# EAGLE design 4_relay_5Switch (EAGLE 7.2.0)
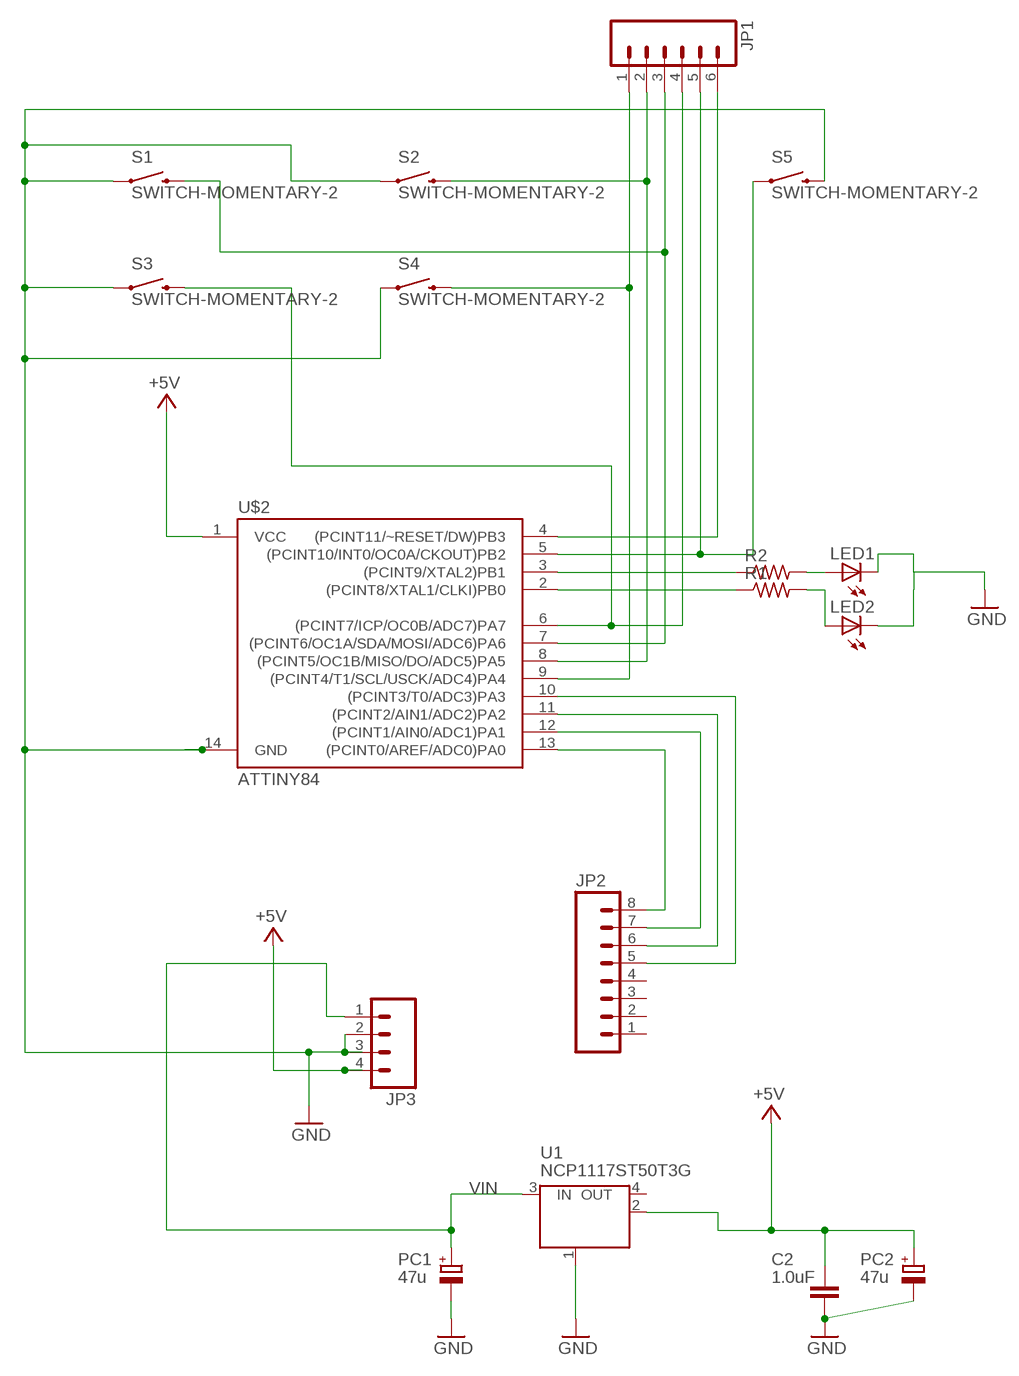
[diagram p0: schematic, sheet 1]

## Parts
C2  1.0uF  1.0UF-25V-+80/-20(0805)  [0805]
JP1  M06NO_SILK_FEMALE_PTH  [1X06_NO_SILK]
JP2  M08NO_SILK  [1X08_PIN1_NO_SILK]
JP3  M041X04_NO_SILK  [1X04_NO_SILK]
LED1  LEDCHIP-LED0805  [CHIP-LED0805]
LED2  LEDCHIP-LED0805  [CHIP-LED0805]
PC1  47u  CPOL-EUE2.5-5V  [E2,5-4R]
PC2  47u  CPOL-EUE2.5-5V  [E2,5-4R]
R1  R-US_R0805  [R0805]
R2  R-US_R0805  [R0805]
S1  SWITCH-MOMENTARY-2  [TACTILE_FSM4JSMATR]
S2  SWITCH-MOMENTARY-2  [TACTILE_FSM4JSMATR]
S3  SWITCH-MOMENTARY-2  [TACTILE_FSM4JSMATR]
S4  SWITCH-MOMENTARY-2  [TACTILE_FSM4JSMATR]
S5  SWITCH-MOMENTARY-2  [TACTILE_FSM4JSMATR]
U1  NCP1117ST50T3G  MC33269ST-3.3T3  [SOT223]
U$2  ATTINY84  [SO14]

## Nets
+5V [usbvcc]: C2.2 JP3.4 PC2.+ U1.2(OUT) U$2.1(VCC)
GND: C2.1 JP3.2 JP3.3 LED1.C LED2.C PC1.- PC2.- S1.P$1 S1.P$2 S2.P$1 S2.P$2 S3.P$1 S3.P$2 S4.P$1 S4.P$2 S5.P$3 S5.P$4 U1.1(GND/ADJ) U$2.14(GND)
N$1: JP1.2 S2.P$3 S2.P$4 U$2.8((PCINT5/OC1B/MISO/DO/ADC5)PA5)
N$2: JP1.6 U$2.4((PCINT11/~RESET/DW)PB3)
N$3: JP1.1 S4.P$3 S4.P$4 U$2.9((PCINT4/T1/SCL/USCK/ADC4)PA4)
N$4: JP2.8 U$2.13((PCINT0/AREF/ADC0)PA0)
N$5: JP1.3 S1.P$3 S1.P$4 U$2.7((PCINT6/OC1A/SDA/MOSI/ADC6)PA6)
N$6: JP2.7 U$2.12((PCINT1/AIN0/ADC1)PA1)
N$7: JP2.6 U$2.11((PCINT2/AIN1/ADC2)PA2)
N$8: JP2.5 U$2.10((PCINT3/T0/ADC3)PA3)
N$9: JP1.4 S3.P$3 S3.P$4 U$2.6((PCINT7/ICP/OC0B/ADC7)PA7)
N$10: JP1.5 S5.P$1 S5.P$2 U$2.5((PCINT10/INT0/OC0A/CKOUT)PB2)
N$11: R2.1 U$2.3((PCINT9/XTAL2)PB1)
N$12: R1.1 U$2.2((PCINT8/XTAL1/CLKI)PB0)
N$13: LED1.A R2.2
N$14: LED2.A R1.2
VIN [power]: JP3.1 PC1.+ U1.3(IN)
Unconnected: JP2.1 JP2.2 JP2.3 JP2.4 U1.4(OUT)

## Library data of the parts
C2 = SparkFun-Capacitors:1.0UF-25V-+80/-20(0805): CAP-11625; PROD_ID: CAP-11625
JP1 = SparkFun-Connectors:M06: Header 6 Standard 6-pin 0.1" header. Use with straight break away headers (SKU : PRT-00116), right angle break away headers (PRT-00553), swiss pins (PRT-00743), machine pins (PRT-00117), and female headers (PRT-00115). Molex polarized connector foot print use with SKU : PRT-08094 with associated crimp pins and housings. NOTES ON THE VARIANTS LOCK and LOCK_LONGPADS... This footprint was designed to help hold the alignment of a through-hole component (i.e. 6-pin header) while soldering it into place. You may notice that each hole has been shifted either up or down by 0.005 of an inch from it's more standard position (which is a perfectly straight line). This slight alteration caused the pins (the squares in the middle) to touch the edges of the holes. Because they are alternating, it causes a "brace" to hold the component in place. 0.005 has proven to be the perfect amount of "off-center" position when using our standard breakaway headers. Although looks a little odd when you look at the bare footprint, once you have a header in there, the alteration is very hard to notice. Also,if you push a header all the way into place, it is covered up entirely on the bottom side. This idea of altering the position of holes to aid alignment will be further integrated into the Sparkfun Library for other footprints. It can help hold any component with 3 or more connection pins.; PROD_ID: CONN-08437
JP2 = SparkFun-Connectors:M08: Header 8 Standard 8-pin 0.1" header. Use with straight break away headers (SKU : PRT-00116), right angle break away headers (PRT-00553), swiss pins (PRT-00743), machine pins (PRT-00117), and female headers (PRT-00115).
JP3 = SparkFun-Connectors:M04: Header 4 Standard 4-pin 0.1" header. Use with straight break away headers (SKU : PRT-00116), right angle break away headers (PRT-00553), swiss pins (PRT-00743), machine pins (PRT-00117), and female headers (PRT-00115). Molex polarized connector foot print use with SKU : PRT-08231 with associated crimp pins and housings. 1MM SMD Version SKU: PRT-10208
LED1 LED2 = adafruit:LED: LED OSRAM: - CHIPLED LG R971, LG N971, LY N971, LG Q971, LY Q971, LO R971, LY R971 LH N974, LH R974 LS Q976, LO Q976, LY Q976 LO Q996 - Hyper CHIPLED LW Q18S LB Q993, LB Q99A, LB R99A - SideLED LS A670, LO A670, LY A670, LG A670, LP A670 LB A673, LV A673, LT A673, LW A673 LH A674 LY A675 LS A676, LA A676, LO A676, LY A676, LW A676 LS A679, LY A679, LG A679 - Hyper Micro SIDELED® LS Y876, LA Y876, LO Y876, LY Y876 LT Y87S - SmartLED LW L88C, LW L88S LB L89C, LB L89S, LG L890 LS L89K, LO L89K, LY L89K LS L896, LA L896, LO L896, LY L896 - TOPLED LS T670, LO T670, LY T670, LG T670, LP T670 LSG T670, LSP T670, LSY T670, LOP T670, LYG T670 LG T671, LOG T671, LSG T671 LB T673, LV T673, LT T673, LW T673 LH T674 LS T676, LA T676, LO T676, LY T676, LB T676, LH T676, LSB T676, LW T676 LB T67C, LV T67C, LT T67C, LS T67K, LO T67K, LY T67K, LW E67C LS E67B, LA E67B, LO E67B, LY E67B, LB E67C, LV E67C, LT E67C LW T67C LS T679, LY T679, LG T679 LS T770, LO T770, LY T770, LG T770, LP T770 LB T773, LV T773, LT T773, LW T773 LH T774 LS E675, LA E675, LY E675, LS T675 LS T776, LA T776, LO T776, LY T776, LB T776 LHGB T686 LT T68C, LB T68C - Hyper Mini TOPLED® LB M676 - Mini TOPLED Santana® LG M470 LS M47K, LO M47K, LY M47K Source: http://www.osram.convergy.de/
PC1 PC2 = rcl:CPOL-EU: POLARIZED CAPACITOR, European symbol
R1 R2 = resistor:R-US_: RESISTOR, American symbol
S1-S5 = SparkFun-Electromechanical_alr:SWITCH-MOMENTARY-2: Various NO switches- pushbuttons, reed, etc
U1 = linear:MC33269ST*: Adjustable Output Low Dropout Voltage Regulator 800 mA Source: http://www.onsemi.com/pub/Collateral/MC33269-D.PDF
U$2 = SparkFun-DigitalIC:ATTINY84: Atmel 14-pin 2/4/8kB flash uC; PROD_ID: IC-11285

## Net classes
1 power: width 0.61 mm, drill 0.61 mm, clearance 0.254 mm
2 gnd: width 0.305 mm, drill 0.559 mm, clearance 0.254 mm
3 usbvcc: width 0.508 mm, drill 0.61 mm, clearance 0.254 mm

## Board
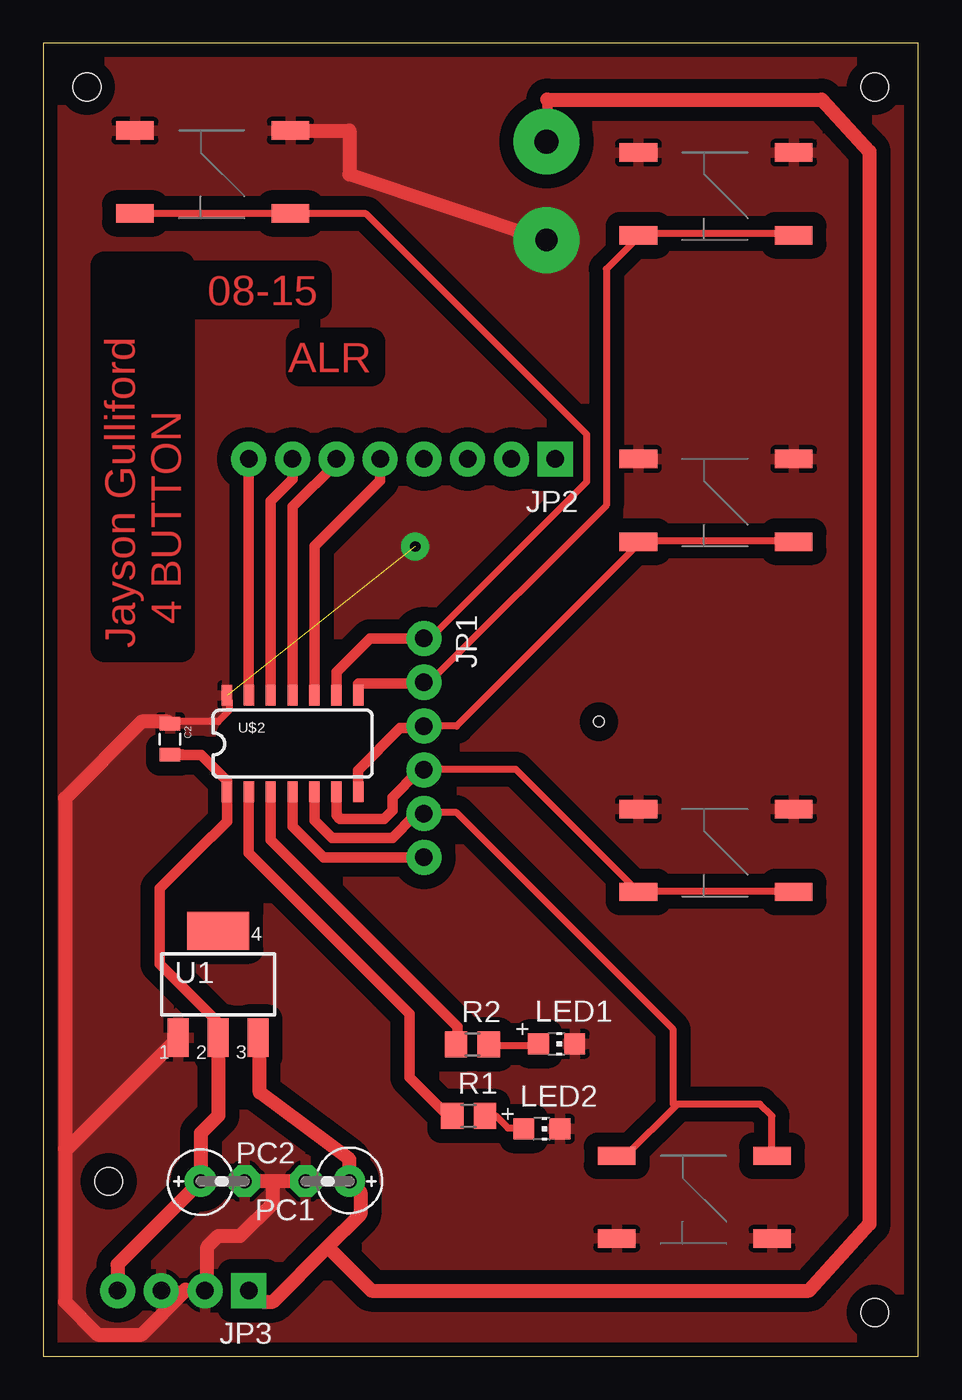
[diagram p1: board, top side]

Size 50.8 x 76.2 mm. Coordinates in mm from the lower left corner, seen from the top.
Outline: 0,0 50.8,0 50.8,76.2 0,76.2 0,0
Copper layers (1*16): Top 0.035mm / dielectric 1.5mm / Bottom 0.035mm
Design rules "SparkFun2 *": minimum track width 16mil, minimum drill 20mil, track to track 20mil, track to pad 20mil, pad to pad 20mil, via to via 20mil, smd to smd 8mil, copper to edge 10mil, drill to drill 8mil, minimum pad ring 20mil, minimum via ring 20mil, stop-mask expansion 5mil, vias tented up to drill 25mil, thermal gap 10mil
Holes 0.6 mm at 32.26,36.83
Holes 1.6 mm at 2.54,73.66 48.26,73.66 48.26,2.54 3.81,10.16
tRestrict: area 11.2,34.5 to 18.3,37

### Footprints (pad centres in the part's own frame; a part is rotated, then mirrored left to right if it is on the bottom)
0805 = smd 0.8 x 1.2: 1 -0.9,0; 2 0.9,0
1X06_NO_SILK = drill 1.016 pad 1.88: 1 0,0; 2 2.54,0; 3 5.08,0; 4 7.62,0; 5 10.16,0; 6 12.7,0
1X08_PIN1_NO_SILK = drill 1.016 pad 1.88 square: 1 0,0 | drill 1.016 pad 1.88: 2 2.54,0; 3 5.08,0; 4 7.62,0; 5 10.16,0; 6 12.7,0; 7 15.24,0; 8 17.78,0
1X04_NO_SILK = drill 1.016 pad 1.88 square: 1 0,0 | drill 1.016 pad 1.88: 2 2.54,0; 3 5.08,0; 4 7.62,0
CHIP-LED0805 = smd 1.2 x 1.2: A 0,-1.05; C 0,1.05
E2,5-4R = drill 0.813 pad 1.6: + -1.27,0 | drill 0.813 pad 1.6 octagon: - 1.27,0
R0805 = smd 1.3 x 1.5: 1 -0.95,0; 2 0.95,0
TACTILE_FSM4JSMATR = smd 1.067 x 2.184: P$1 0,0; P$2 0,9.017; P$3 4.801,9.017; P$4 4.801,0
SOT223 = smd 1.219 x 2.235: 1 -2.311,-3.099; 2 0,-3.099; 3 2.311,-3.099 | smd 3.6 x 2.2: 4 0,3.099
SO14 = smd 0.6 x 1.2: 1 -3.81,-2.8; 2 -2.54,-2.8; 3 -1.27,-2.8; 4 0,-2.8; 5 1.27,-2.8; 6 2.54,-2.8; 7 3.81,-2.8; 8 3.81,2.8; 9 2.54,2.8; 10 1.27,2.8; 11 0,2.8; 12 -1.27,2.8; 13 -2.54,2.8; 14 -3.81,2.8

### Placement (x,y rotation side)
C2  7.37,35.81 270 top
JP1  22.1,41.66 270 top
JP2  29.72,52.07 180 top
JP3  11.94,3.81 180 top
LED1  29.8,18.13 270 top
LED2  28.95,13.21 270 top
PC1  16.51,10.16 180 top
PC2  10.41,10.16 0 top
R1  24.7,13.95 0 top
R2  24.91,18.1 0 top
S1  34.54,52.07 270 top
S2  34.54,69.85 270 top
S3  34.54,31.75 270 top
S4  5.33,71.12 270 top
S5  33.29,11.64 270 top
U1  10.16,21.59 0 top
U$2  14.48,35.56 0 top

### Tracks (layer width: path | path; a pad name or v marks a point on that pad's centre or on a via)
+5V
  Top 0.61: C2.2 8.08,34.92 8.1,34.9 9.17,34.9 10.67,33.4 U$2.1 10.67,31.04 9.78,30.15 9.75,30.15 6.76,27.15 6.76,22.78 10.19,19.36 10.19,18.52 U1.2
  Top 0.813: U1.2 10.16,13.97 9.14,12.95 PC2.+ 4.32,5.33 JP3.4
GND  (via drill 0.6, 1.3 pad 3.81)  (1 unrouted)
  Top 0.406: JP3.3 6.86,3.89 8.26,3.89 9.37,3.89 JP3.2 | C2.1 7.62,36.83 10.16,36.83 10.79,37.47 10.79,38.1 U$2.14 | 34.75,31.55 S3.P$1 34.75,31.55
  Top 0.813: 1.27,12.06 1.27,32.38 5.71,36.83 7.24,36.83 C2.1 | 1.27,12.06 1.27,3.17 3.17,1.27 5.71,1.27 8.26,3.81 8.26,3.89 | U1.1 1.42,12.06 1.27,12.06 | PC1.- 13.34,10.16 | 13.34,10.16 PC2.- | 9.37,3.89 9.53,4.04 9.53,6.35 10.16,6.99 11.43,6.99 13.34,8.89 13.34,10.16 | S4.P$2 17.78,71.12 17.78,68.58 v29.21,64.77
  other vias: 21.59,46.99
  pour Top (isolate 0.813): 57.29,-5.41 62.37,84.76 -4.25,85.28 -4.25,-5.52
N$1
  Top 0.406: S2.P$3 43.43,65.15 34.75,65.15 S2.P$4 34.52,64.92 32.69,63.09 32.69,49.38 22.4,39.09 JP1.2
  Top 0.61: U$2.8 18.29,39.01 18.31,39.04 21.82,39.04 JP1.2
N$2
  Top 0.61: U$2.4 14.48,30.76 16.28,28.96 JP1.6
N$3
  Top 0.406: S4.P$4 5.49,66.29 14.17,66.29 S4.P$3 14.4,66.29 18.75,66.29 31.55,53.49 31.55,50.75 22.17,41.38 JP1.1
  Top 0.61: U$2.9 17.02,39.7 18.97,41.66 JP1.1
N$4
  Top 0.61: U$2.13 JP2.8
N$5
  Top 0.406: S1.P$3 43.43,47.32 34.75,47.32 S1.P$4 34.52,47.09 24,36.58 JP1.3
  Top 0.61: U$2.7 18.29,34.01 20.73,36.45 21.82,36.45 JP1.3
N$6
  Top 0.61: U$2.12 13.21,49.63 14.48,50.9 JP2.7
N$7
  Top 0.61: U$2.11 14.48,49.3 17.02,51.84 JP2.6
N$8
  Top 0.61: U$2.10 15.75,47.02 19.56,50.83 JP2.5
N$9
  Top 0.406: S3.P$3 43.43,26.98 34.75,26.98 S3.P$4 27.43,34.06 22.4,34.06 JP1.4
  Top 0.61: U$2.6 17.02,31.42 17.25,31.19 19.79,31.19 20.27,31.67 20.27,32.44 21.74,33.91 21.82,33.91 JP1.4
N$10
  Top 0.406: 36.69,14.52 36.8,14.63 41.6,14.63 42.29,13.95 42.29,11.66 S5.P$2 | 36.69,14.52 33.83,11.66 33.38,11.66 S5.P$1 | JP1.5 22.4,31.55 24,31.55 36.58,18.97 36.58,14.63 36.69,14.52
  Top 0.61: U$2.5 15.75,31.09 16.76,30.07 20.27,30.07 21.54,31.34 21.82,31.34 JP1.5
N$11
  Top 0.61: U$2.3 13.21,29.96 24.06,19.11 24.06,18.2 R2.1
N$12
  Top 0.61: R1.1 23.51,13.95 21.28,16.18 21.28,19.88 11.94,29.22 U$2.2
N$13
  Top 0.406: LED1.A 28.57,18.06 26.06,18.06 R2.2
N$14
  Top 0.406: LED2.A 27.89,13.26 26.98,13.26 26.29,13.95 25.83,13.95 R1.2
VIN  (via drill 1.4 pad 3.81)
  Top 0.61: 12.57,18.29 U1.3 | 17.6,10.29 PC1.+ | 29.26,72.92 v29.21,70.48
  Top 0.813: 12.57,18.29 12.57,15.32 17.78,11.43 17.78,10.29 17.6,10.29 | PC1.+ 18.41,9.53 18.41,8.26 16.51,6.35 | 16.51,6.35 13.34,3.17 12.7,3.17 12.06,3.81 JP3.1 | 16.51,6.35 19.05,3.81 44.45,3.81 47.95,7.68 47.95,69.91 45.19,72.92 29.26,72.92

### Text on the board
Top: 08-15 | ALR | Jayson Gulliford / 4 BUTTON